# Altium schematic sheet Schematic_AltiumDesigner.SchDoc
size A; SheetNumber: 1; SheetTotal: 1
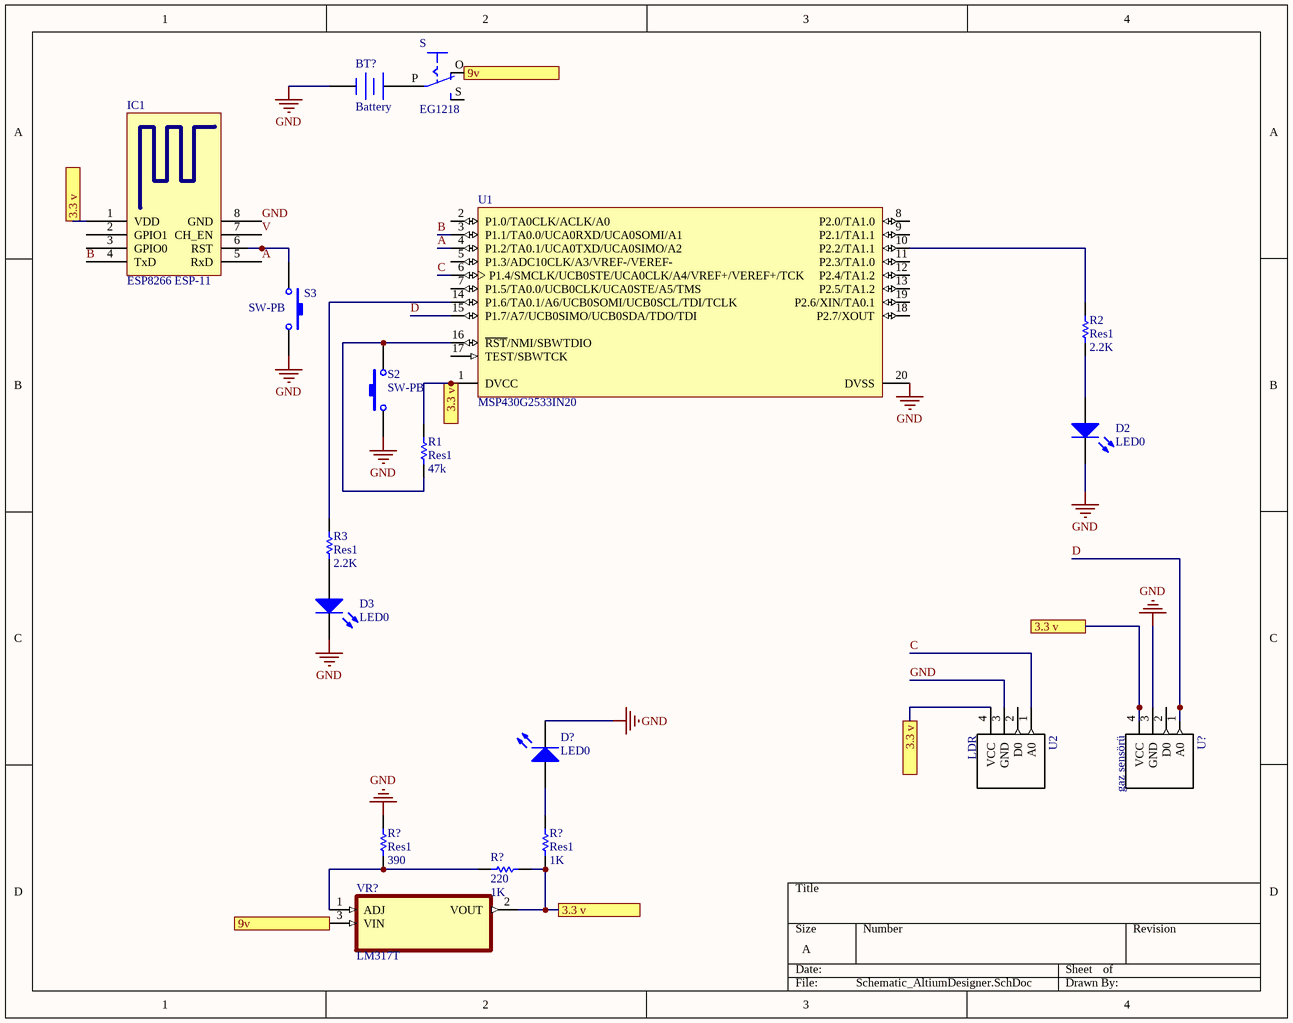
[diagram p0: Schematic_AltiumDesigner.SchDoc]

## Parts
(Parts that share a designator on the sheet are numbered #1, #2 ... from top to bottom, then left to right.)
BT?  Battery  [BAT-2]
D2  LED0  [LED-0]
D3  LED0  [LED-0]
D?  LED0  [LED-0]
IC1  ESP8266 ESP-11  [ESP8266 ESP-01]
R1  Res1  value 47k  [AXIAL-0.3]
R2  Res1  value 2.2K  [AXIAL-0.3]
R3  Res1  value 2.2K  [AXIAL-0.3]
R?#1  Res1  value 390  [AXIAL-0.3]
R?#2  220  value 1K  [AXIAL-0.3]
R?#3  Res1  value 1K  [AXIAL-0.3]
S  EG1218  [EG1218]
S2  SW-PB  [SPST-2]
S3  SW-PB  [SPST-2]
U1  MSP430G2533IN20  [TI-N20]
U2  LDR  [XCVR_HC-SR04]
U?  gaz sensörü  [XCVR_HC-SR04]
VR?  LM317T  [TO254P1054X470X1955-3]

## Ports
3.3 v, 9v

## Nets
GND: BT?.2(-) D2.2(K) D3.2(K) D?.2(K) IC1.8(GND) R?#1.2 S2.1 S3.2 U1.20(DVSS) U2.3(GND) U?.3(GND)
3.3 v: IC1.1(VDD) R1.2 R?#2.2 R?#3.1 U1.1(DVCC) U2.4(VCC) U?.4(VCC) VR?.2(VOUT) ; port 3.3 v
9v: S.O VR?.3(VIN) ; port 9v
A: IC1.5(RxD) U1.4(P1.2/TA0.1/UCA0TXD/UCA0SIMO/A2)
B: IC1.4(TxD) U1.3(P1.1/TA0.0/UCA0RXD/UCA0SOMI/A1)
C: U1.6(P1.4/SMCLK/UCB0STE/UCA0CLK/A4/VREF+/VEREF+/TCK) U2.1(A0)
D: U1.15(P1.7/A7/UCB0SIMO/UCB0SDA/TDO/TDI) U?.1(A0)
V: IC1.7(CH_EN)
NetBT?_1: BT?.1(+) S.P
NetD2_1: D2.1(A) R2.1
NetD3_1: D3.1(A) R3.1
NetD?_1: D?.1(A) R?#3.2
NetIC1_6: IC1.6(RST) S3.1
NetR1_1: R1.1 S2.2 U1.16(~{RST}/NMI/SBWTDIO)
NetR2_2: R2.2 U1.10(P2.2/TA1.1)
NetR3_2: R3.2 U1.14(P1.6/TA0.1/A6/UCB0SOMI/UCB0SCL/TDI/TCLK)
NetR?#1_1: R?#1.1 R?#2.1 VR?.1(ADJ)

Not connected (* = marked no-connect by the designer): IC1 2(GPIO1) 3(GPIO0); S S; U1 2(P1.0/TA0CLK/ACLK/A0) 5(P1.3/ADC10CLK/A3/VREF-/VEREF-) 7(P1.5/TA0.0/UCB0CLK/UCA0STE/A5/TMS) 8(P2.0/TA1.0) 9(P2.1/TA1.1) 11(P2.3/TA1.0) 12(P2.4/TA1.2) 13(P2.5/TA1.2) 17(TEST/SBWTCK) 18(P2.7/XOUT) 19(P2.6/XIN/TA0.1); U2 2(D0); U? 2(D0)

## Library data of the parts
BT? = Battery: Multicell Battery; Published: 24-Mar-1999; LatestRevisionDate: 17-Jul-2002; LatestRevisionNote: Re-released for DXP Platform.; PackageReference: BAT-2; Publisher: Altium Limited; PackageDescription: Battery; 2 Leads
D2 D3 D? = LED0: Typical INFRARED GaAs LED; Published: 8-Jun-2000; LatestRevisionDate: 08-Jul-2005; LatestRevisionNote: Mech Layer 1 removed.; PackageReference: LED-0; Publisher: Altium Limited; PackageDescription: LED; 2 Leads
R1-R3 R?#1-R?#3 = Res1: Resistor; Published: 8-Jun-2000; LatestRevisionDate: 17-Jul-2002; LatestRevisionNote: Re-released for DXP Platform.; PackageReference: AXIAL-0.3; Publisher: Altium Limited; PackageDescription: Axial Device, Thru-Hole; 2 Leads; 0.3 in Pin Spacing
S = EG1218: æ»‘å‹•é–‹é—œSPDTé€šå­”; MF: E-Switch; Package: Custom package E-Switch; Price: None; MP: EG1218; Availability: Unavailable; Value: *; SnapEDA_Link: https://www.snapeda.com/parts/EG1218/E-Switch/view-part/13895/?ref=snap
S2 S3 = SW-PB: Switch; Published: 24-Mar-1999; LatestRevisionDate: 17-Jul-2002; LatestRevisionNote: Re-released for DXP Platform.; PackageReference: SPST-2; Publisher: Altium Limited; PackageDescription: Switch; 2 Leads
U1 = MSP430G2533IN20: 16 MHz Mixed Signal Microcontroller with 16 KB Flash, 512 B SRAM and 24 GPIOs, -40 to 85 degC, 20-pin DIP (N), Pb-Free (RoHS); Manufacturer: Texas Instruments; ADC: 10-bit SAR; ADC Channels: 8; Brown Out Reset: Yes; Flash(KB): 16; GPIO: 24; SRAM(B): 512; SubFamily: Value Line; Timers - 16-bit: 2; USCI_A (UART/LIN/IrDA/SPI): 1; DatasheetVersion: SLAS734D; PackageVersion: 4040049/E; PackageReference: N20; PackageDescription: 20-Pin Plastic In-Line, Body 25.40 x 6.35 mm, Pitch 2.54 mm; Supplier 1: Digi-Key; Supplier Part Number 1: MSP430G2513IRHB32T-ND; Supplier 2: Mouser; Supplier Part Number 2: 595-P430G2513IRHB32T; Cap touch I/O: Yes; Eco-Plan: Pb-Free (RoHS); Frequency(MHz): 16; Temp Sensor: Yes; USCI_B (I2C & SPI): 1; Watchdog: Yes; Mounting Technology: Through Hole; Code_JEDEC: MS-001; PartNumber: MSP430G2533IN20; ComponentLink1Description: Manufacturer URL; ComponentLink1URL: http://www.ti.com/; ComponentLink2Description: Datasheet; ComponentLink2URL: http://www.ti.com/general/docs/lit/getliterature.tsp?genericPartNumber=MSP430G2533&fileType=pdf; ComponentLink3Description: Package Specification; ComponentLink3URL: http://www.ti.com/litv/pdf/mpds177g
U2 = HC-SR04
U? = HC-SR04: LDR
VR? = LM317T: 1.5-A, 40-V, adjustable linear voltage regulator 3-TO-220; MF: Texas Instruments; Arrow_Electronics-Purchase-URL: https://snapeda.com/shop?store=Arrow+Electronics&id=2756289; Price: None; Value: *; Availability: Unavailable; DigiKey-Purchase-URL: https://snapeda.com/shop?store=DigiKey&id=2756289; Mouser-Purchase-URL: https://snapeda.com/shop?store=Mouser&id=2756289; SnapEDA_Link: https://www.snapeda.com/parts/LM317T/Texas%20Instruments/view-part/2756289/?ref=snap; MP: LM317T; Package: TO-220-3 Texas Instruments